# Altium schematic sheet 主控板电路.SchDoc
size A4
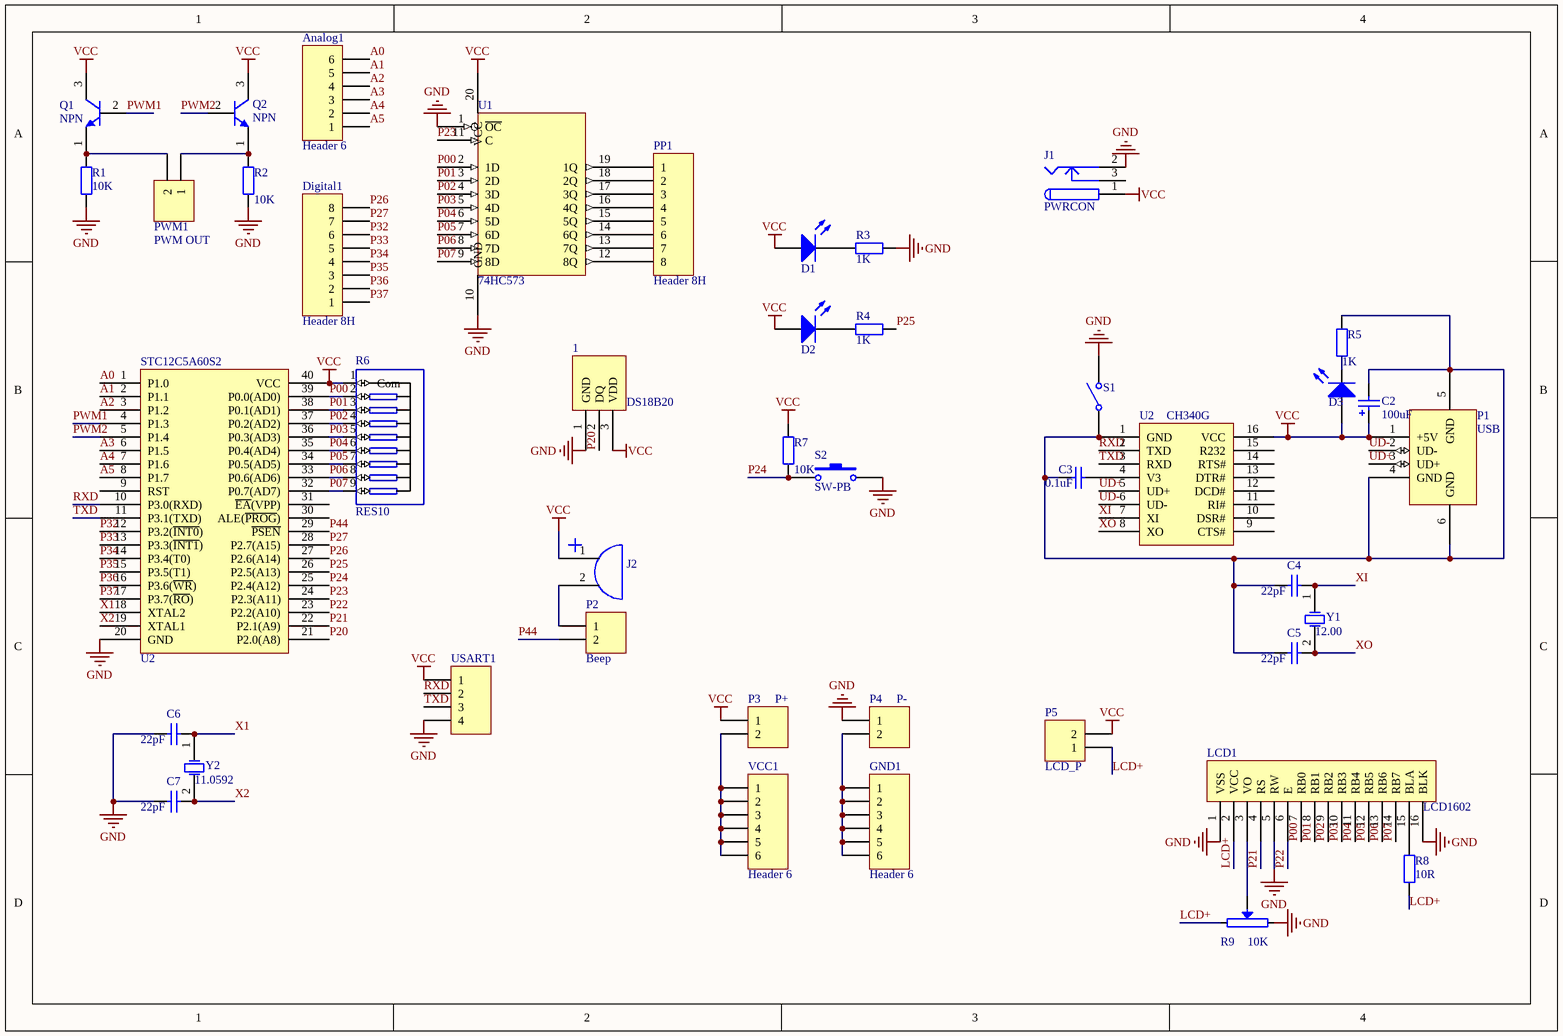
[diagram p0: 主控板电路.SchDoc]

## Parts
1  DS18B20  [TO-92A]
Analog1  Header 6  [HDR1X6]
C2  value 100uF  [RB.1/.3]  (hidden comment: Cap Pol2)
C3  value 0.1uF  [CAPR5-4X5]  (hidden comment: Cap Semi)
C4  value 22pF  [CAPR5-4X5]  (hidden comment: Cap Semi)
C5  value 22pF  [CAPR5-4X5]  (hidden comment: Cap Semi)
C6  value 22pF  [CAPR5-4X5]  (hidden comment: Cap Semi)
C7  value 22pF  [CAPR5-4X5]  (hidden comment: Cap Semi)
D1  LED0  [LED_A2]  (value not drawn)
D2  LED0  [LED_A2]  (value not drawn)
D3  LED0  [LED_A2]  (value not drawn)
Digital1  Header 8H  [HDR1X8]
GND1  Header 6  [HDR1X6]
J1  PWRCON  [DC-005]
J2  BEEP-S  [BEEP-S]  (value not drawn)
LCD1  LCD1602  [HDR1X16]
P1  USB  [USB]
P2  Beep  [HDR1X2]
P3  P+  [HDR1X2]
P4  P-  [HDR1X2]
P5  LCD_P  [HDR1X2]
PP1  Header 8H  [HDR1X8]
PWM1  PWM OUT  [HDR1X2]
Q1  NPN  [TO-92A]
Q2  NPN  [TO-92A]
R1  value 10K  [AXIAL-0.4]  (hidden comment: Res2)
R2  value 10K  [AXIAL-0.4]  (hidden comment: Res2)
R3  value 1K  [AXIAL-0.4]  (hidden comment: Res2)
R4  value 1K  [AXIAL-0.4]  (hidden comment: Res2)
R5  value 1K  [AXIAL-0.4]  (hidden comment: Res2)
R6  RES10  [SIP9]
R7  value 10K  [AXIAL-0.4]  (hidden comment: Res2)
R8  value 10R  [AXIAL-0.4]  (hidden comment: Res2)
R9  10K  [RVR-2]
S1  SW-SPST  [SWITCH_B1]  (value not drawn)
S2  SW-PB  [SW-80]
STC12C5A60S2  U2  [DIP-40]
U1  74HC573  [DIP-20]
U2  CH340G  [SOIC127P600X170-16N]
USART1  Header 4  [HDR1X4]  (value not drawn)
VCC1  Header 6  [HDR1X6]
Y1  value 12.00  [XTAL]  (hidden comment: XTAL)
Y2  value 11.0592  [XTAL]  (hidden comment: XTAL)

## Nets
GND: 1.1(GND) C6.2 C7.2 J1.2 LCD1.1(VSS) LCD1.5(RW) LCD1.16(BLK) P4.1 R1.1 R2.1 R3.1 R9.2 S1.2(NO) S2.2 STC12C5A60S2.20(GND) U1.1(~{OC}) U1.10(GND) USART1.4
VCC: 1.3(VDD) C2.1 D1.1(A) D2.1(A) D3.1(A) J1.1 J2.1 P1.1(+5V) P3.1 P5.2 Q1.3(C) Q2.3(C) R6.1(Com) R7.2 STC12C5A60S2.40(VCC) U1.20(VCC) U2.16(VCC) USART1.1
A0: Analog1.6 STC12C5A60S2.1(P1.0)
A1: Analog1.5 STC12C5A60S2.2(P1.1)
A2: Analog1.4 STC12C5A60S2.3(P1.2)
A3: Analog1.3 STC12C5A60S2.6(P1.5)
A4: Analog1.2 STC12C5A60S2.7(P1.6)
A5: Analog1.1 STC12C5A60S2.8(P1.7)
LCD+: LCD1.2(VCC) P5.1 R8.1 R9.1
P00: LCD1.7(RB0) R6.2 STC12C5A60S2.39(P0.0(AD0)) U1.2(1D)
P01: LCD1.8(RB1) R6.3 STC12C5A60S2.38(P0.1(AD1)) U1.3(2D)
P02: LCD1.9(RB2) R6.4 STC12C5A60S2.37(P0.2(AD2)) U1.4(3D)
P03: LCD1.10(RB3) R6.5 STC12C5A60S2.36(P0.3(AD3)) U1.5(4D)
P04: LCD1.11(RB4) R6.6 STC12C5A60S2.35(P0.4(AD4)) U1.6(5D)
P05: LCD1.12(RB5) R6.7 STC12C5A60S2.34(P0.5(AD5)) U1.7(6D)
P06: LCD1.13(RB6) R6.8 STC12C5A60S2.33(P0.6(AD6)) U1.8(7D)
P07: LCD1.14(RB7) R6.9 STC12C5A60S2.32(P0.7(AD7)) U1.9(8D)
P20: 1.2(DQ) STC12C5A60S2.21(P2.0(A8))
P21: LCD1.4(RS) STC12C5A60S2.22(P2.1(A9))
P22: LCD1.6(E) STC12C5A60S2.23(P2.2(A10))
P23: STC12C5A60S2.24(P2.3(A11)) U1.11(C)
P24: R7.1 S2.1 STC12C5A60S2.25(P2.4(A12))
P25: R4.1 STC12C5A60S2.26(P2.5(A13))
P26: Digital1.8 STC12C5A60S2.27(P2.6(A14))
P27: Digital1.7 STC12C5A60S2.28(P2.7(A15))
P32: Digital1.6 STC12C5A60S2.12(P3.2(~{INT0}))
P33: Digital1.5 STC12C5A60S2.13(P3.3(~{INT1}))
P34: Digital1.4 STC12C5A60S2.14(P3.4(T0))
P35: Digital1.3 STC12C5A60S2.15(P3.5(T1))
P36: Digital1.2 STC12C5A60S2.16(P3.6(~{WR}))
P37: Digital1.1 STC12C5A60S2.17(P3.7(~{RO}))
P44: P2.2 STC12C5A60S2.29(~{PSEN})
PWM1: Q1.2(B) STC12C5A60S2.4(P1.3)
PWM2: Q2.2(B) STC12C5A60S2.5(P1.4)
RXD: STC12C5A60S2.10(P3.0(RXD)) U2.2(TXD) USART1.2
TXD: STC12C5A60S2.11(P3.1(TXD)) U2.3(RXD) USART1.3
UD+: P1.3(UD+) U2.5(UD+)
UD-: P1.2(UD-) U2.6(UD-)
X1: C6.1 STC12C5A60S2.18(XTAL2) Y2.1(OSC1)
X2: C7.1 STC12C5A60S2.19(XTAL1) Y2.2(OSC2)
XI: C4.1 U2.7(XI) Y1.1(OSC1)
XO: C5.1 U2.8(XO) Y1.2(OSC2)
NetC2_2: C2.2 C3.2 C4.2 C5.2 P1.4(GND) P1.5(GND) P1.6(GND) R5.2 S1.1(COMMON) U2.1(GND)
NetC3_1: C3.1 U2.4(V3)
NetD1_2: D1.2(K) R3.2
NetD2_2: D2.2(K) R4.2
NetD3_2: D3.2(K) R5.1
NetGND1_1: GND1.1 GND1.2 GND1.3 GND1.4 GND1.5 GND1.6 P4.2
NetJ2_2: J2.2 P2.1
NetLCD1_3: LCD1.3(VO) R9.W
NetLCD1_15: LCD1.15(BLA) R8.2
NetP3_2: P3.2 VCC1.1 VCC1.2 VCC1.3 VCC1.4 VCC1.5 VCC1.6
NetPP1_1: PP1.1 U1.19(1Q)
NetPP1_2: PP1.2 U1.18(2Q)
NetPP1_3: PP1.3 U1.17(3Q)
NetPP1_4: PP1.4 U1.16(4Q)
NetPP1_5: PP1.5 U1.15(5Q)
NetPP1_6: PP1.6 U1.14(6Q)
NetPP1_7: PP1.7 U1.13(7Q)
NetPP1_8: PP1.8 U1.12(8Q)
NetPWM1_1: PWM1.1 Q2.1(E) R2.2
NetPWM1_2: PWM1.2 Q1.1(E) R1.2

Not connected (* = marked no-connect by the designer): J1 3; STC12C5A60S2 9(RST) 30(ALE(~{PROG})) 31(~{EA}(VPP)); U2 9(CTS#) 10(DSR#) 11(RI#) 12(DCD#) 13(DTR#) 14(RTS#) 15(R232)

## Library data of the parts
1 = DS18B20: 温度传感器
Analog1 GND1 VCC1 = Header 6: Header, 6-Pin; LatestRevisionDate: 17-Jul-2002; LatestRevisionNote: Re-released for DXP Platform.; Publisher: Altium Limited
C2 = Cap Pol2: Polarized Capacitor (Axial); Published: 8-Jun-2000; LatestRevisionDate: 17-Jul-2002; LatestRevisionNote: Re-released for DXP Platform.; PackageReference: POLAR0.8; Publisher: Altium Limited; PackageDescription: Polarized Capacitor; 2 Leads
C3-C7 = Cap Semi: Capacitor (Semiconductor SIM Model); Published: 8-Jun-2000; LatestRevisionDate: 29-May-2009; LatestRevisionNote: IPC-7351 Footprint Added.; PackageReference: C1206; Publisher: Altium Limited; PackageDescription: Chip Capacitor
D1-D3 = LED0: 发光二极管; Published: 8-Jun-2000; LatestRevisionDate: 08-Jul-2005; LatestRevisionNote: Mech Layer 1 removed.; PackageReference: LED-0; Publisher: Altium Limited
Digital1 PP1 = Header 8H: Header, 8-Pin, Right Angle; LatestRevisionDate: 17-Jul-2002; LatestRevisionNote: Re-released for DXP Platform.; Publisher: Altium Limited
J1 = PWRCON: 直流电源端子; Published: 17-Dec-2003; DatasheetDocument: 09-May-2002; Publisher: Altium Limited; ComponentLink1Description: Manufacturer Link; ComponentLink1URL: http://domino.kycon.com/internet/Products.html
J2 = BEEP-S: 有源蜂鸣器
P1 = USB: USB Port
P2-P5 PWM1 = Header 2: Header, 2-Pin; LatestRevisionDate: 17-Jul-2002; LatestRevisionNote: Re-released for DXP Platform.; Publisher: Altium Limited
Q1 Q2 = NPN2: 三极管; Published: 8-Jun-2000; LatestRevisionDate: 15-Jan-2003; LatestRevisionNote: PCB Footprint 'BCY-W3/D4.7' replaced; DatasheetDocument: 1997; PackageDocument: Sep-1998; PackageReference: TO-92A; Publisher: Altium Limited; Code_JEDEC: TO-92A; ComponentLink1Description: Manufacturer Link; ComponentLink1URL: http://www.fairchildsemi.com/; ComponentLink2Description: Datasheet; ComponentLink2URL: http://www.fairchildsemi.com/ds/2N%2F2N3904.pdf
R1-R5 R7 R8 = Res2: Resistor; Published: 8-Jun-2000; LatestRevisionDate: 17-Jul-2002; LatestRevisionNote: Re-released for DXP Platform.; PackageReference: AXIAL-0.4; Publisher: Altium Limited; PackageDescription: Axial Device, Thru-Hole; 2 Leads; 0.4 in Pin Spacing
R9 = VR
S1 = SW-SPST: Single-Pole, Single-Throw Switch; Published: 24-Mar-1999; LatestRevisionDate: 17-Jul-2002; LatestRevisionNote: Re-released for DXP Platform.; PackageReference: SPST-2; Publisher: Altium Limited; PackageDescription: Switch; 2 Leads
S2 = SW-PB: Switch; Published: 24-Mar-1999; LatestRevisionDate: 17-Jul-2002; LatestRevisionNote: Re-released for DXP Platform.; PackageReference: SPST-2; Publisher: Altium Limited; PackageDescription: Switch; 2 Leads
STC12C5A60S2 = 89C51
U2 = Component_1
USART1 = Header 4: Header, 4-Pin; LatestRevisionDate: 17-Jul-2002; LatestRevisionNote: Re-released for DXP Platform.; Publisher: Altium Limited
Y1 Y2 = XTAL: Crystal Oscillator; Published: 8-Jun-2000; LatestRevisionDate: 17-Jul-2002; LatestRevisionNote: Re-released for DXP Platform.; PackageReference: R38; Publisher: Altium Limited; PackageDescription: Crystal, Thru-Hole; 2 Leads; Body 3.1 x 8.2 mm (Dia.xH)